# Altium schematic sheet NMOS_SOT-23.schdoc
size 127 x 101 mm
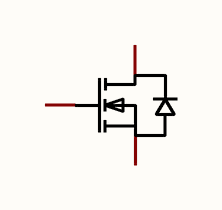
[diagram p0: NMOS_SOT-23.schdoc]

## Parts
Q?  CJ2312  [SOT-23_L2.9-W1.3-P1.90-LS2.4-BR]  (value not drawn)

## Nets

Not connected (* = marked no-connect by the designer): Q? 1(G) 2(S) 3(D)

## Library data of the parts
Q? = CJ2312: Manufacturer: CJ(江苏长电/长晶); Add into BOM: yes; Type: N沟道; Drain Source Voltage (Vdss): 20V; Continuous Drain Current (Id): 5A; Power Dissipation (Pd): 350mW; Drain Source On Resistance (RDS(on)@Vgs,Id): 31.8mΩ@4.5V,5A; Gate Threshold Voltage (Vgs(th)@Id): 1V@250uA; Symbol: CJ2312; Device: CJ2312; LCSC Part Name: N沟道 耐压:20V 电流:5A; Supplier Part: C23521; Manufacturer Part: CJ2312; Supplier Footprint: SOT-23; JLCPCB Part Class: Extended Part; Datasheet: https://atta.szlcsc.com/upload/public/pdf/source/20131225/1457706664116.pdf; Supplier: LCSC; Convert to PCB: yes